# EAGLE design rover bt remote (EAGLE 9.6.2)
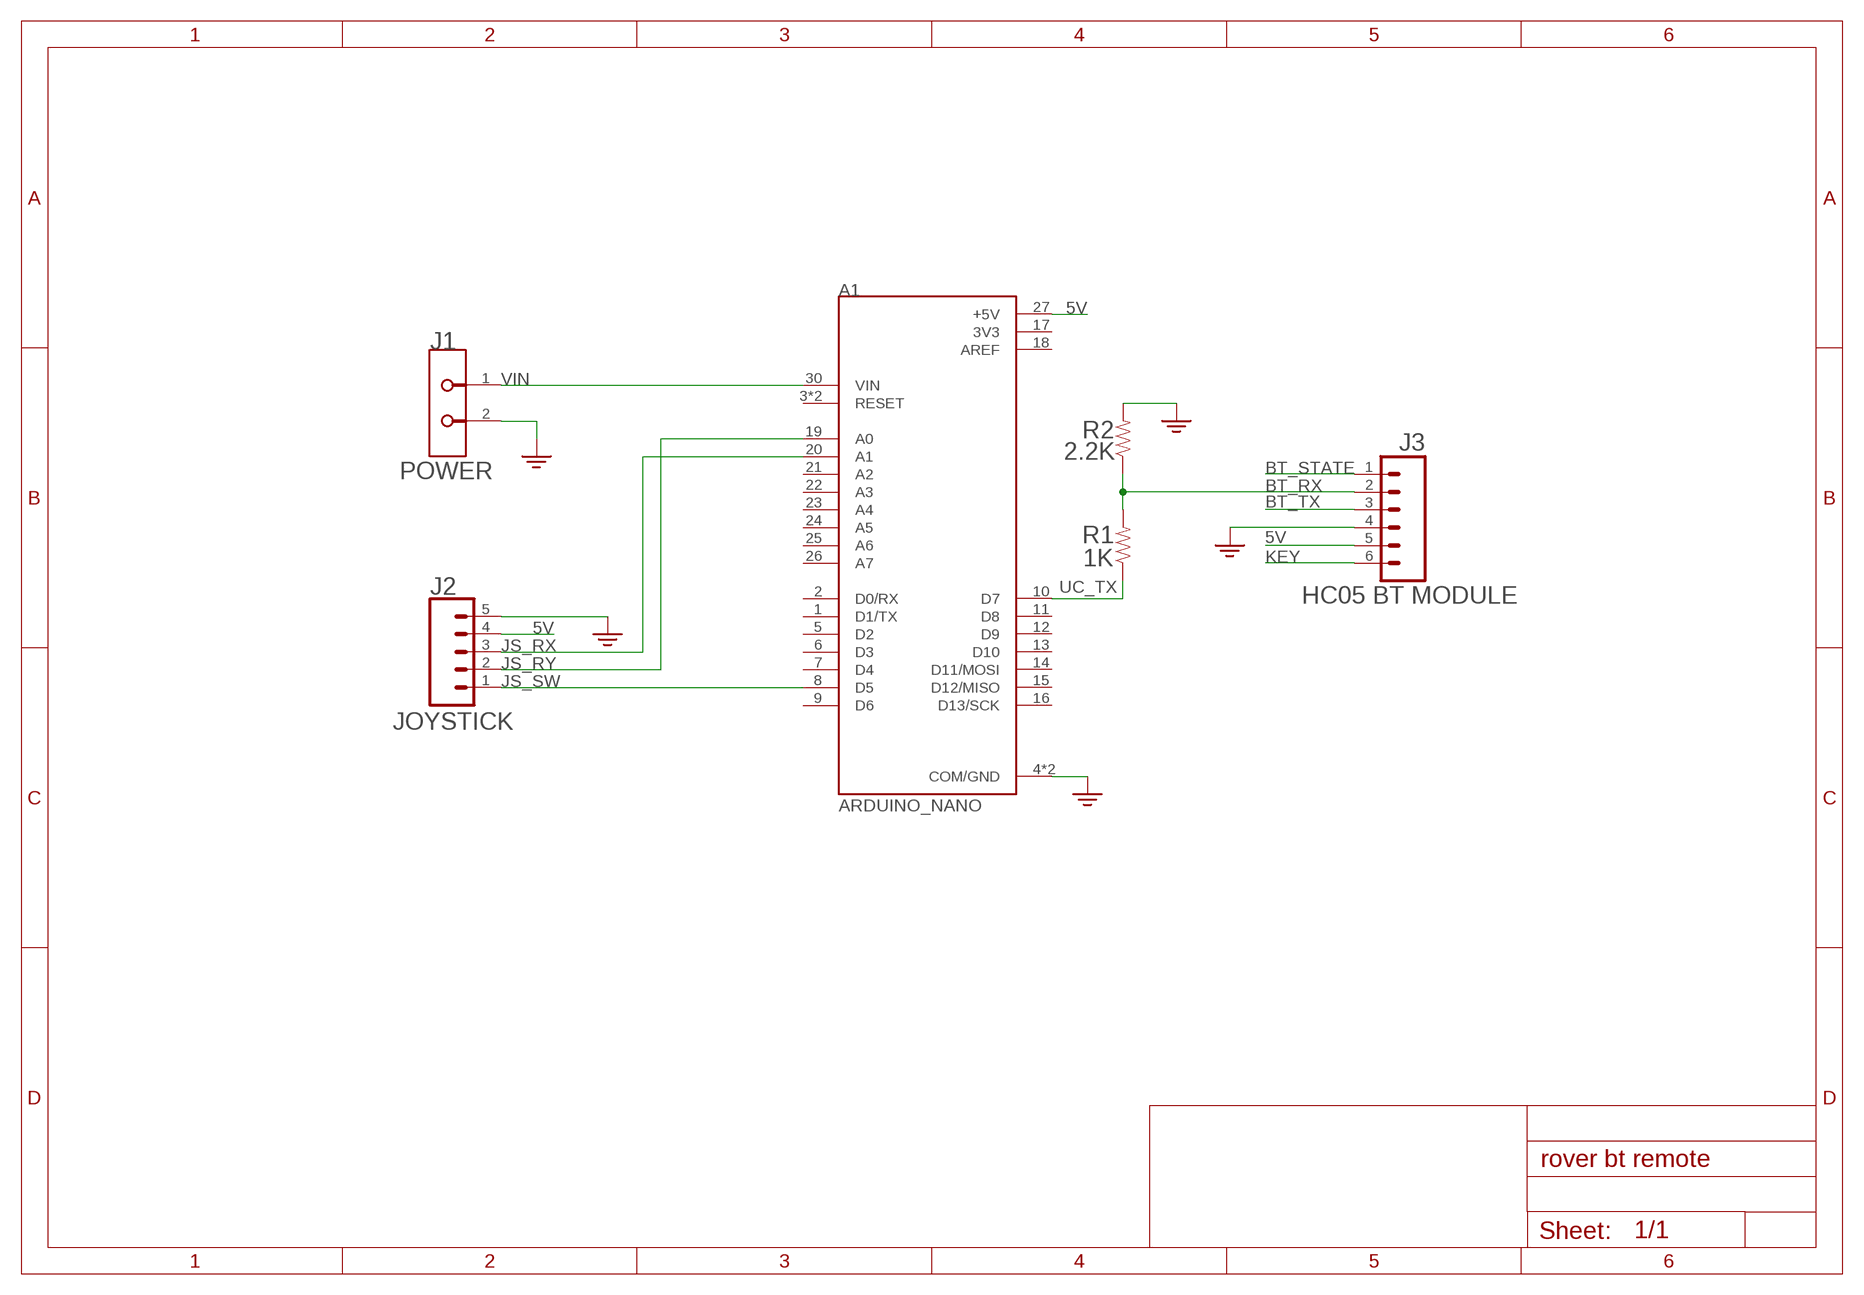
[diagram p0: schematic, sheet 1]

## Parts
A1  ARDUINO_NANO  [SHIELD_ARDUINO_NANO]
J1  POWER  TE_282837-2TE_282837-2_0_0  [TE_282837-2_0]
J2  JOYSTICK  CONN_05  [1X05]
J3  HC05 BT MODULE  CONN_06SILK_FEMALE_PTH  [1X06]
R1  1K  RESISTORAXIAL-0.3  [AXIAL-0.3]
R2  2.2K  RESISTORAXIAL-0.3  [AXIAL-0.3]

## Nets
5V: A1.27(+5V) J2.4 J3.5
BT_RX: J3.2 R1.P$2 R2.P$1
BT_STATE: J3.1
BT_TX: J3.3
GND: A1.4(COM/GND) A1.29(COM/GND) J1.2 J2.5 J3.4 R2.P$2 ; supply symbol labelled GND2
JS_RX: A1.20(A1) J2.3
JS_RY: A1.19(A0) J2.2
JS_SW: A1.8(D5) J2.1
KEY: J3.6
UC_TX: A1.10(D7) R1.P$1
VIN: A1.30(VIN) J1.1
Unconnected: A1.1(D1/TX) A1.2(D0/RX) A1.3(RESET) A1.5(D2) A1.6(D3) A1.7(D4) A1.9(D6) A1.11(D8) A1.12(D9) A1.13(D10) A1.14(D11/MOSI) A1.15(D12/MISO) A1.16(D13/SCK) A1.21(A2) A1.22(A3) A1.23(A4) A1.24(A5) A1.25(A6) A1.26(A7) A1.28(RESET)

## Power pins joined to a net without a drawn wire
3V3: A1.17(3V3)
AREF: A1.18(AREF)

## Library data of the parts
A1 = ARDUINO_NANO:ARDUINO_NANO: Arduino Nano, Through Hole Check prices <https://pricing.snapeda.com/parts/ARDUINO%20NANO/Arduino/view-part?ref=eda>; AVAILABILITY: In Stock; DESCRIPTION: ATmega4809 Arduino Nano Every with Headers AVR® AVR MCU 8-Bit Embedded Evaluation Board; MF: Arduino; MP: ARDUINO NANO; PACKAGE: None; PRICE: None
J1 = RMDrv_FinalNew_Conn_Terminal:TE_282837-2: Conn Terminal Blocks F 2 POS 5.08mm Solder ST Thru-Hole 13.5A/Contact; CENTROID_NOT_SPECIFIED: No; CONN_GENDER: Female; CONN_ORIENTATION: Horizontal; CONTACT_MATERIAL: Tin; CURRENT_RATING: 13.5A; DATASHEET: https://www.te.com/commerce/DocumentDelivery/DDEController?Action=showdoc&DocId=Catalog+Section%7F1308389_EUROSTYLE_TERMINAL_BLOCKS%7F0607%7Fpdf%7FEnglish%7FENG_CS_1308389_EUROSTYLE_TERMINAL_BLOCKS_0607.pdf%7F282837-2; DEVICE_CLASS_L1: Connectors; DEVICE_CLASS_L2: Terminal Blocks | Terminals; DEVICE_CLASS_L3: unset; DIGIKEY_DESCRIPTION: CONN TERM BLOCK 5.08MM 2POS SIDE ENTY; DIGIKEY_PART_NUMBER: A113320-ND; FOOTPRINT_URL: https://www.te.com/commerce/DocumentDelivery/DDEController?Action=showdoc&DocId=Customer+Drawing%7F282837%7FH%7Fpdf%7FEnglish%7FENG_CD_282837_H.pdf%7F282837-2; HEIGHT: 10.3mm; IS_FEMALE: yes; LEAD_FREE: yes; MAX_WIRE_GAUGE: 16; MF: TE; MFG_PACKAGE_IDENT: 282837-2; MFG_PACKAGE_IDENT_DATE: 0; MFG_PACKAGE_IDENT_REV: 0; MIN_WIRE_GAUGE: 30; MOUSER_DESCRIPTION: Fixed Terminal Blocks 5.08MM PCB MOUNT 2P; MOUSER_PART_NUMBER: 571-2828372; MPN: 282837-2; NUMBER_OF_CONTACTS: 2; NUMBER_OF_ROWS: 1; PACKAGE: HDR2; PREFIX: J; ROHS: yes; TEMPERATURE_RANGE_HIGH: +110°C; TEMPERATURE_RANGE_LOW: -40°C; VERIFICATION_VERSION: 0.0.0.1; VOLTAGE_RATING: 300V
J2 = SparkFun-Connectors:CONN_05: Multi connection point. Often used as Generic Header-pin footprint for 0.1 inch spaced/style header connections On any of the 0.1 inch spaced packages, you can populate with these: Break Away Headers - Straight <https://www.sparkfun.com/products/116> (PRT-00116) Break Away Male Headers - Right Angle <https://www.sparkfun.com/products/553> (PRT-00553) Female Headers <https://www.sparkfun.com/products/115> (PRT-00115) Break Away Headers - Machine Pin <https://www.sparkfun.com/products/117> (PRT-00117) Break Away Female Headers - Swiss Machine Pin <https://www.sparkfun.com/products/743> (PRT-00743) For SCREWTERMINALS and SPRING TERMINALS visit here: Screw Terimnals on SparkFun.com <https://www.sparkfun.com/search/results?term=Screw+Terminals> (5mm/3.5mm/2.54mm spacing) This device is also useful as a general connection point to wire up your design to another part of your project. Our various solder wires solder well into these plated through hole pads. Hook-Up Wire - Assortment (Stranded, 22 AWG) <https://www.sparkfun.com/products/11375> (PRT-11375) Hook-Up Wire - Assortment (Solid Core, 22 AWG) <https://www.sparkfun.com/products/11367> (PRT-11367) View the entire wire category on our website here <https://www.sparkfun.com/categories/141> Special notes: Molex polarized connector foot print use with SKU : PRT-08231 with associated crimp pins and housings. 1MM SMD Version SKU: PRT-10208
J3 = SparkFun-Connectors:CONN_06: Multi connection point. Often used as Generic Header-pin footprint for 0.1 inch spaced/style header connections On any of the 0.1 inch spaced packages, you can populate with these: Break Away Headers - Straight <https://www.sparkfun.com/products/116> (PRT-00116) Break Away Male Headers - Right Angle <https://www.sparkfun.com/products/553> (PRT-00553) Female Headers <https://www.sparkfun.com/products/115> (PRT-00115) Break Away Headers - Machine Pin <https://www.sparkfun.com/products/117> (PRT-00117) Break Away Female Headers - Swiss Machine Pin <https://www.sparkfun.com/products/743> (PRT-00743) Arduino Stackable Header - 6 Pin <https://www.sparkfun.com/products/9280> (PRT-09280) For SCREWTERMINALS and SPRING TERMINALS visit here: Screw Terimnals on SparkFun.com <https://www.sparkfun.com/search/results?term=Screw+Terminals> (5mm/3.5mm/2.54mm spacing) This device is also useful as a general connection point to wire up your design to another part of your project. Our various solder wires solder well into these plated through hole pads. Hook-Up Wire - Assortment (Stranded, 22 AWG) <https://www.sparkfun.com/products/11375> (PRT-11375) Hook-Up Wire - Assortment (Solid Core, 22 AWG) <https://www.sparkfun.com/products/11367> (PRT-11367) View the entire wire category on our website here <https://www.sparkfun.com/categories/141>; PROD_ID: CONN-08437
R1 R2 = SparkFun-Resistors:RESISTOR: Generic Resistor Package

## Board
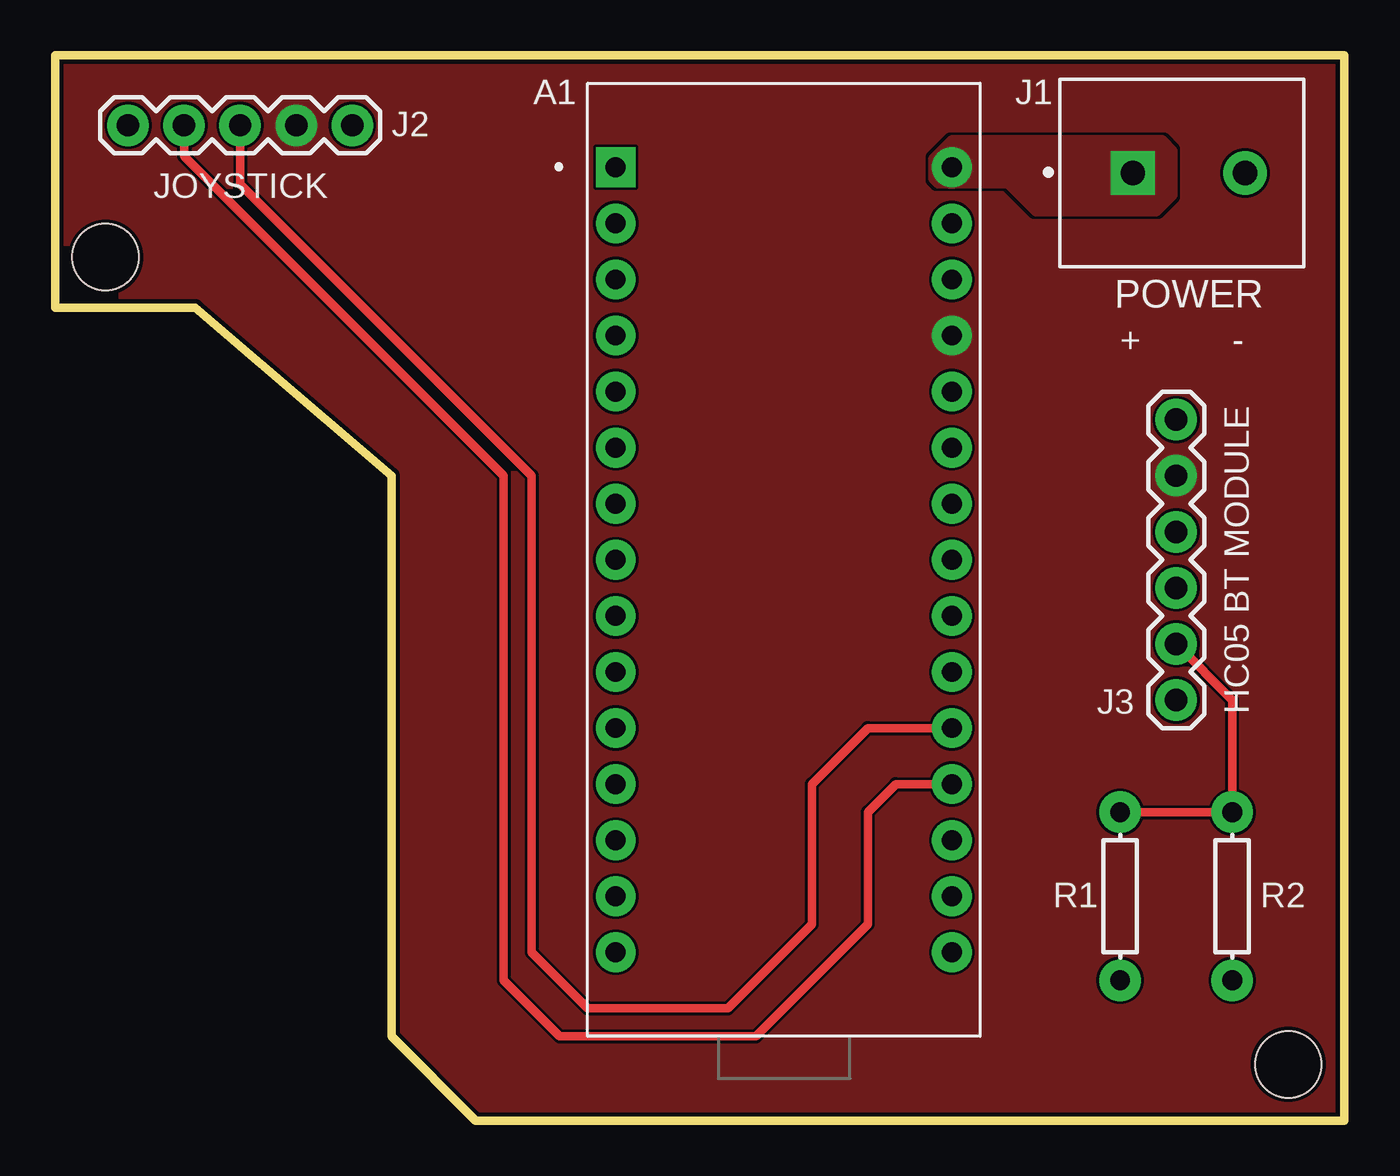
[diagram p1: board, top side]
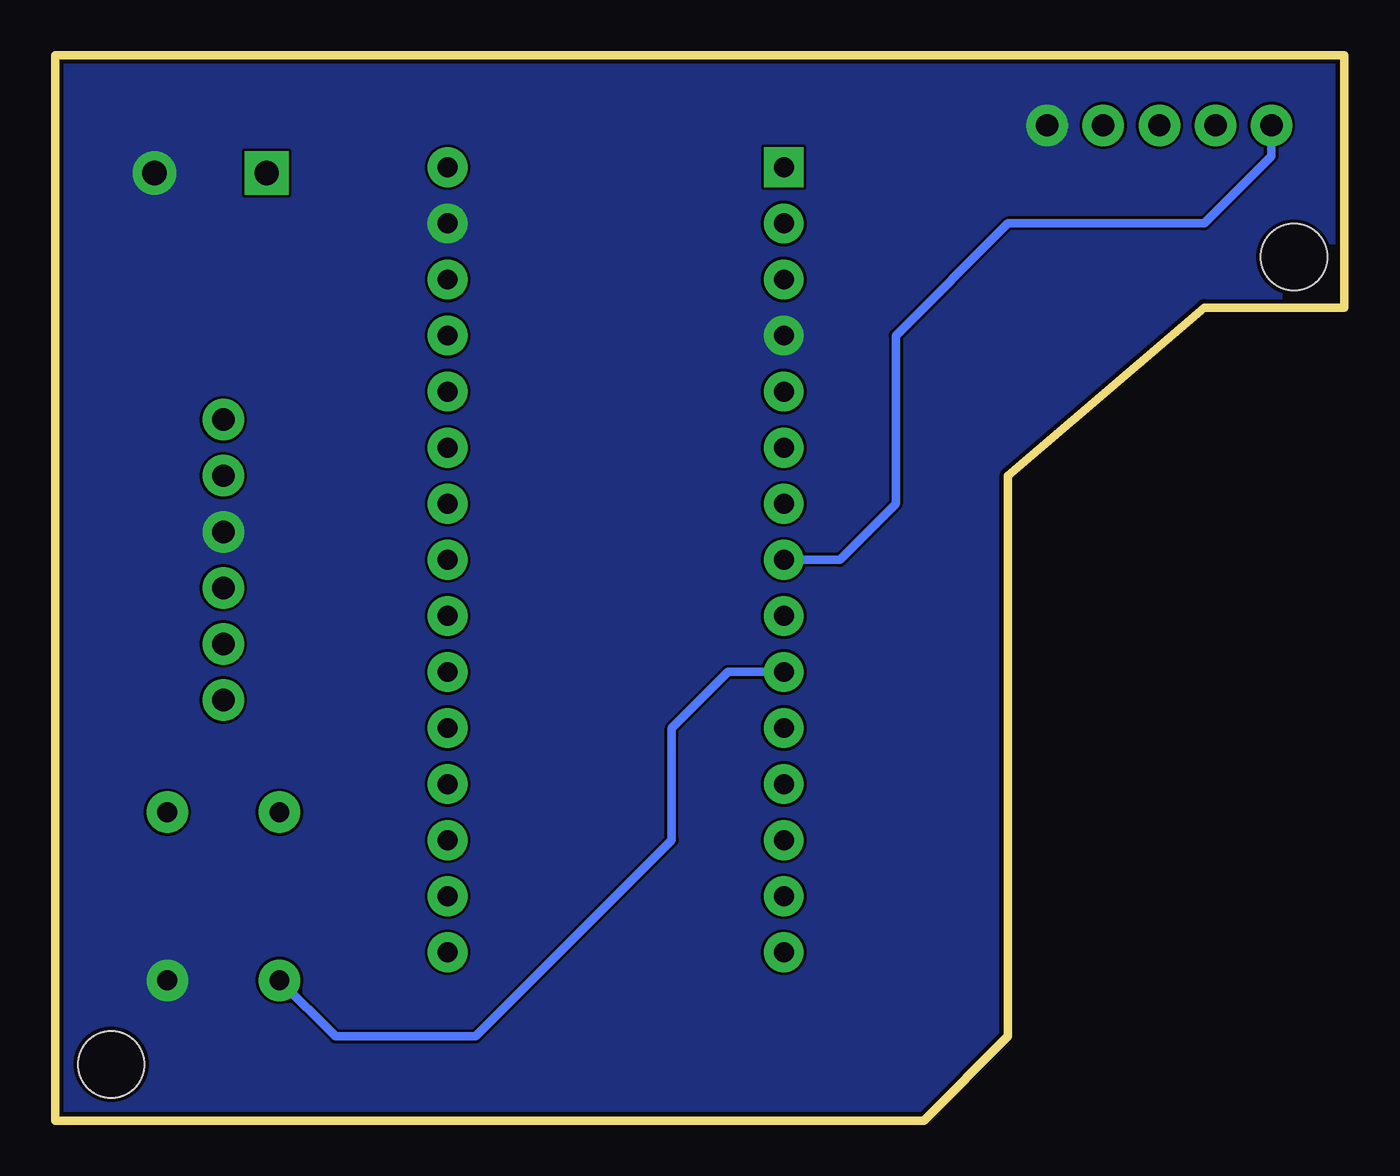
[diagram p2: board, bottom side, seen from below]

Size 58.42 x 48.26 mm. Coordinates in mm from the lower left corner, seen from the top.
Outline: 19.05,0 15.24,3.81 15.24,29.21 6.35,36.83 0,36.83 0,48.26 58.42,48.26 58.42,0 19.05,0
Copper layers (1*16): Top 0.035mm / dielectric 1.6mm / Bottom 0.035mm
Design rules "jlcpcb-2layers": minimum track width 5mil, minimum drill 0.3mm, track to track 5mil, track to pad 5mil, pad to pad 5mil, via to via 5mil, smd to smd 5mil, copper to edge 0.2mm, drill to drill 6mil, minimum pad ring 10mil, minimum via ring 3mil, stop-mask expansion 4mil, vias tented up to drill 0mil, thermal gap 10mil
Holes 3 mm at 55.88,2.54 2.29,39.12

### Footprints (pad centres in the part's own frame; a part is rotated, then mirrored left to right if it is on the bottom)
SHIELD_ARDUINO_NANO = drill 0.9 pad 1.8 square: 1 -7.62,17.78 | drill 0.9 pad 1.8: 2 -7.62,15.24; 3 -7.62,12.7; 4 -7.62,10.16; 5 -7.62,7.62; 6 -7.62,5.08; 7 -7.62,2.54; 8 -7.62,0; 9 -7.62,-2.54; 10 -7.62,-5.08; 11 -7.62,-7.62; 12 -7.62,-10.16; 13 -7.62,-12.7; 14 -7.62,-15.24; 15 -7.62,-17.78; 16 7.62,-17.78; 17 7.62,-15.24; 18 7.62,-12.7; 19 7.62,-10.16; 20 7.62,-7.62; 21 7.62,-5.08; 22 7.62,-2.54; 23 7.62,0; 24 7.62,2.54; 25 7.62,5.08; 26 7.62,7.62; 27 7.62,10.16; 28 7.62,12.7; 29 7.62,15.24; 30 7.62,17.78
TE_282837-2_0 = drill 1.1 pad 1.7 square: 1 -2.215,0 | drill 1.1 pad 1.7: 2 2.865,0
1X05 = drill 1.016 pad 1.88: 1 0,0; 2 2.54,0; 3 5.08,0; 4 7.62,0; 5 10.16,0
1X06 = drill 1.016 pad 1.88: 1 0,0; 2 2.54,0; 3 5.08,0; 4 7.62,0; 5 10.16,0; 6 12.7,0
AXIAL-0.3 = drill 0.9 pad 1.88: P$1 -3.81,0; P$2 3.81,0

### Placement (x,y rotation side)
A1  33.02,25.4 0 top
J1  51.05,42.93 0 top
J2  3.3,45.09 0 top
J3  50.8,19.05 90 top
R1  48.26,10.16 90 top
R2  53.34,10.16 270 top

### Tracks (layer width: path | path; a pad name or v marks a point on that pad's centre or on a via)
5V
  pour Top (rank 2, no thermals): 0,36.83 0,48.26 58.42,48.26 58.42,0 19.05,0 15.24,3.81 15.24,29.21 6.35,36.83
BT_RX
  Top 0.381: R1.P$2 R2.P$1 53.34,19.05 J3.2
GND
  pour Bottom (no thermals): 0,48.26 58.42,48.26 58.42,0 19.05,0 15.24,3.81 15.24,29.21 6.35,36.83 0,36.83
JS_RX
  Top 0.381: A1.20 36.83,17.78 34.29,15.24 34.29,8.89 30.48,5.08 24.13,5.08 21.59,7.62 21.59,29.21 8.38,42.42 J2.3
JS_RY
  Top 0.381: A1.19 38.1,15.24 36.83,13.97 36.83,8.89 31.75,3.81 22.86,3.81 20.32,6.35 20.32,29.21 5.84,43.69 J2.2
JS_SW
  Bottom 0.381: J2.1 3.3,43.69 6.35,40.64 15.24,40.64 20.32,35.56 20.32,27.94 22.86,25.4 A1.8
UC_TX
  Bottom 0.381: R1.P$1 45.72,3.81 39.37,3.81 30.48,12.7 30.48,17.78 27.94,20.32 A1.10
VIN
  pour Top (no thermals): 44.45,44.45 49.4,44.45 50.16,44.45 50.67,43.94 50.67,42.42 50.67,41.91 50.04,41.28 49.91,41.15 44.45,41.15 43.43,42.16 43.18,42.42 40.51,42.42 40.01,42.42 39.75,42.67 39.75,43.56 40.64,44.45

### Text on the board
tPlace: + | -